# Altium schematic sheet BLE.SchDoc
size A; SheetNumber: 13; SheetTotal: 15
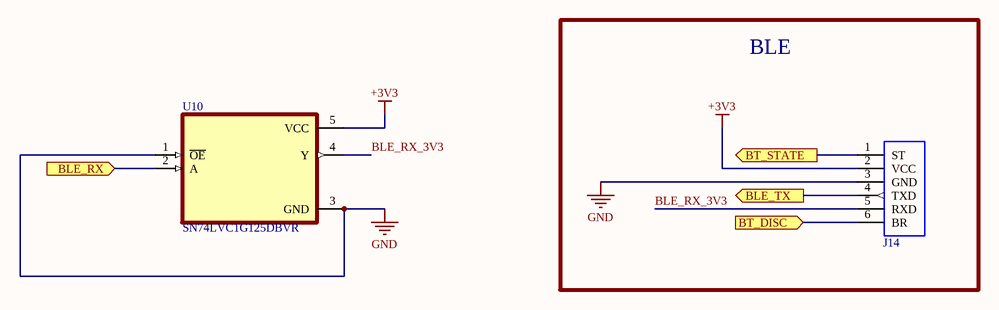
[diagram p0: BLE.SchDoc]

## Parts
J14  61300611821  [HM-10_BLE_MODULE]  (value not drawn)
U10  SN74LVC1G125DBVR  [SOT95P280X145-5N]

## Blocks framed on the sheet
BLE: J14

## Ports
BLE_RX (in, see Block Diagram[4B]), BLE_TX (out, see Block Diagram[4B]), BT_DISC (in, see Block Diagram[4B], ATMEGA2560-16AU[1C]), BT_STATE (out, see Block Diagram[4B], ATMEGA2560-16AU[1C])

## Nets
+3V3: J14.2(VCC) U10.5(VCC)
GND: J14.3(GND) U10.1(~{OE}) U10.3(GND)
BLE_RX: U10.2(A) ; port BLE_RX
BLE_RX_3V3: J14.5(RXD) U10.4(Y)
BLE_TX: J14.4(TXD) ; port BLE_TX
BT_DISC: J14.6(BR) ; port BT_DISC
BT_STATE: J14.1(ST) ; port BT_STATE

## Library data of the parts
J14 = HM-10_BLE_MODULE: WR-PHD Socket Header, THT, Vertical, pitch 2.54mm, 1 Row, 6P; Manufacturer: Wurth Elektronik; Contact Resistance: 20mΩ; Rated Current: 3A; Working Voltage: 250V; Withstanding Voltage: 500V; ComponentLink1Description: Website Link; ComponentLink1URL: https://www.we-online.com/redexpert/article/61300611821?ad; ComponentLink2Description: Datasheet Link; ComponentLink2URL: https://www.we-online.com/redexpert/spec/61300611821?ad; Manufacturer Part Number: 61300611821; Category: Board-to-Board Connectors; Match Code: WR-PHD; Mount: Through Hole; Operating Temperature Max: 125°C; Operating Temperature Min: -40°C; Packaging: Tray; Gender: Socket Header; Number of Pins: 6; Number of Rows: 1; Orientation: Vertical; Pitch: 2.54mm
U10 = SN74LVC1G125DBVR: Single Bus Buffer Gate With 3-State Outputs 5-SOT-23 -40 to 125; MF: Texas Instruments; Purchase-URL: https://pricing.snapeda.com/search/part/SN74LVC1G125DBVR/?ref=eda; Package: SOT-23-5 Texas Instruments; MP: SN74LVC1G125DBVR; Price: None; Availability: Good; Value: *; Check_prices: https://www.snapeda.com/parts/SN74LVC1G125DBVR/Texas%20Instruments/view-part/249684/?ref=eda; SnapEDA_Link: https://www.snapeda.com/parts/SN74LVC1G125DBVR/Texas%20Instruments/view-part/249684/?ref=snap